# Altium schematic sheet PLACAInterconexion.SchDoc
size A4; Organization: Altium Limited; Address1: L3, 12a Rodborough Rd; Address2: Frenchs Forest; Address3: NSW; Address4: Australia 2086
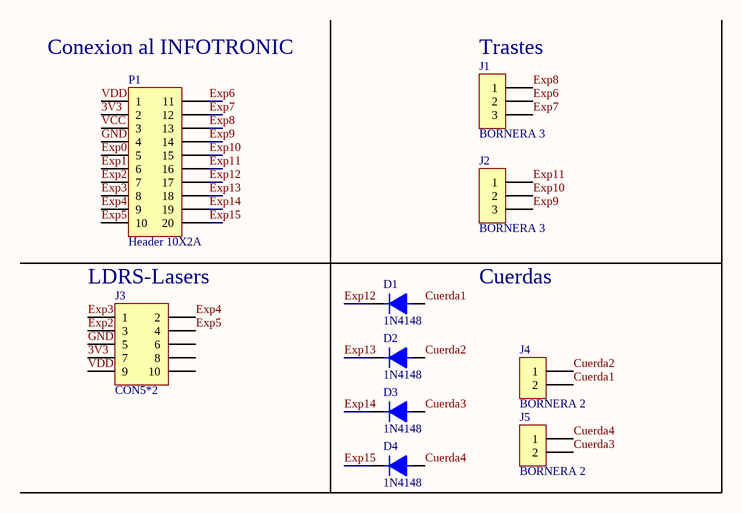
[diagram p0: PLACAInterconexion.SchDoc]

## Parts
D1  1N4148  [DO41]
D2  1N4148  [DO41]
D3  1N4148  [DO41]
D4  1N4148  [DO41]
J1  BORNERA 3  [BORNERA3]
J2  BORNERA 3  [BORNERA3]
J3  CON5*2  [SIP5*2]
J4  BORNERA 2  [BORNERA2]
J5  BORNERA 2  [BORNERA2]
P1  Header 10X2A  [HDR2X10_CEN]

## Nets
3V3: J3.7 P1.2
Cuerda1: D1.1 J4.2
Cuerda2: D2.1 J4.1
Cuerda3: D3.1 J5.2
Cuerda4: D4.1 J5.1
Exp0: P1.5
Exp1: P1.6
Exp2: J3.3 P1.7
Exp3: J3.1 P1.8
Exp4: J3.2 P1.9
Exp5: J3.4 P1.10
Exp6: J1.2 P1.11
Exp7: J1.3 P1.12
Exp8: J1.1 P1.13
Exp9: J2.3 P1.14
Exp10: J2.2 P1.15
Exp11: J2.1 P1.16
Exp12: D1.2 P1.17
Exp13: D2.2 P1.18
Exp14: D3.2 P1.19
Exp15: D4.2 P1.20
GND: J3.5 P1.4
VCC: P1.3
VDD: J3.9 P1.1

Not connected (* = marked no-connect by the designer): J3 6 8 10

## Notes on the sheet
- (near P1) Conexion al INFOTRONIC
- (near J1) Trastes
- LDRS-Lasers
- Cuerdas
- Title
- Size:
- Date:
- A4
- Number:
- Time:
- Revision:
- Sheet
- of
- File:

## Library data of the parts
D1-D4 = DIODO
P1 = Header 10X2A: Header, 10-Pin, Dual row; LatestRevisionDate: 17-Jul-2002; LatestRevisionNote: Re-released for DXP Platform.; Publisher: Altium Limited